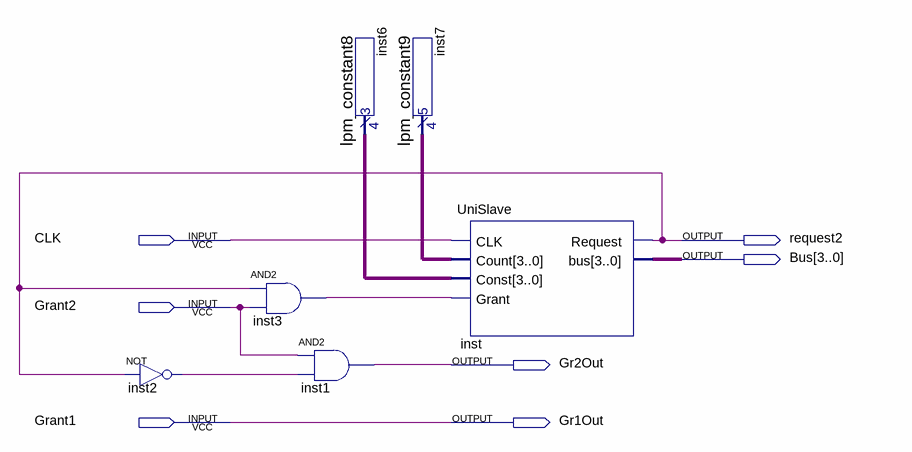
[diagram p0: schematic sheet]
// Quartus schematic Block5.bdf as structural Verilog: 6 symbols, 7 pins
module Block5 (
  input  CLK,
  input  Grant2,
  input  Grant1,
  output request2,
  output [3:0] Bus,
  output Gr2Out,
  output Gr1Out
);

  wire inst2_out, inst3_out;
  wire [3:0] inst6_result, inst7_result;

  not inst2 (inst2_out, request2);
  and inst3 (inst3_out, request2, Grant2);
  and inst1 (Gr2Out, Grant2, inst2_out);
  lpm_constant8 inst6 (.result(inst6_result));
  lpm_constant9 inst7 (.result(inst7_result));
  UniSlave inst (
    .CLK(CLK), .Count(inst7_result), .Const(inst6_result), .Grant(inst3_out), .Request(request2), .bus(Bus));

  assign Gr1Out = Grant1;
endmodule
